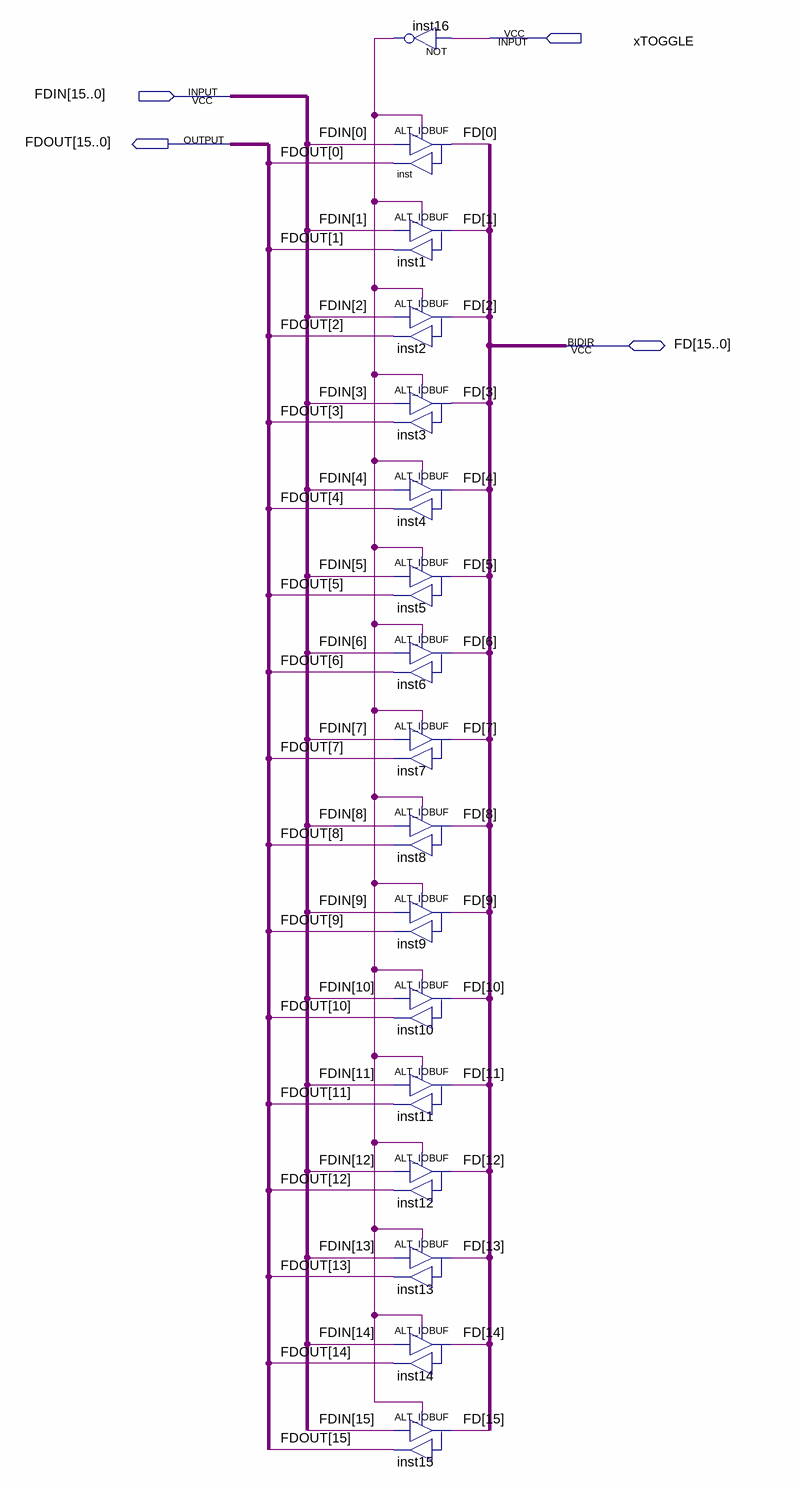
[diagram p0: schematic sheet]
// Quartus schematic IO16.bdf as structural Verilog: 17 symbols, 4 pins
module IO16 (
  input  xTOGGLE,
  input  [15:0] FDIN,
  inout  [15:0] FD,
  output [15:0] FDOUT
);

  wire inst16_out;

  not inst16 (inst16_out, xTOGGLE);
  ALT_IOBUF inst (.i(FDIN[0]), .oe(inst16_out), .o(FDOUT[0]), .io(FD[0]));
  ALT_IOBUF inst1 (.i(FDIN[1]), .oe(inst16_out), .o(FDOUT[1]), .io(FD[1]));
  ALT_IOBUF inst2 (.i(FDIN[2]), .oe(inst16_out), .o(FDOUT[2]), .io(FD[2]));
  ALT_IOBUF inst3 (.i(FDIN[3]), .oe(inst16_out), .o(FDOUT[3]), .io(FD[3]));
  ALT_IOBUF inst4 (.i(FDIN[4]), .oe(inst16_out), .o(FDOUT[4]), .io(FD[4]));
  ALT_IOBUF inst5 (.i(FDIN[5]), .oe(inst16_out), .o(FDOUT[5]), .io(FD[5]));
  ALT_IOBUF inst6 (.i(FDIN[6]), .oe(inst16_out), .o(FDOUT[6]), .io(FD[6]));
  ALT_IOBUF inst7 (.i(FDIN[7]), .oe(inst16_out), .o(FDOUT[7]), .io(FD[7]));
  ALT_IOBUF inst8 (.i(FDIN[8]), .oe(inst16_out), .o(FDOUT[8]), .io(FD[8]));
  ALT_IOBUF inst9 (.i(FDIN[9]), .oe(inst16_out), .o(FDOUT[9]), .io(FD[9]));
  ALT_IOBUF inst10 (.i(FDIN[10]), .oe(inst16_out), .o(FDOUT[10]), .io(FD[10]));
  ALT_IOBUF inst11 (.i(FDIN[11]), .oe(inst16_out), .o(FDOUT[11]), .io(FD[11]));
  ALT_IOBUF inst12 (.i(FDIN[12]), .oe(inst16_out), .o(FDOUT[12]), .io(FD[12]));
  ALT_IOBUF inst13 (.i(FDIN[13]), .oe(inst16_out), .o(FDOUT[13]), .io(FD[13]));
  ALT_IOBUF inst14 (.i(FDIN[14]), .oe(inst16_out), .o(FDOUT[14]), .io(FD[14]));
  ALT_IOBUF inst15 (.i(FDIN[15]), .oe(inst16_out), .o(FDOUT[15]), .io(FD[15]));
endmodule
